# Altium project ARDUINO_MSP430F2370.PrjPCB
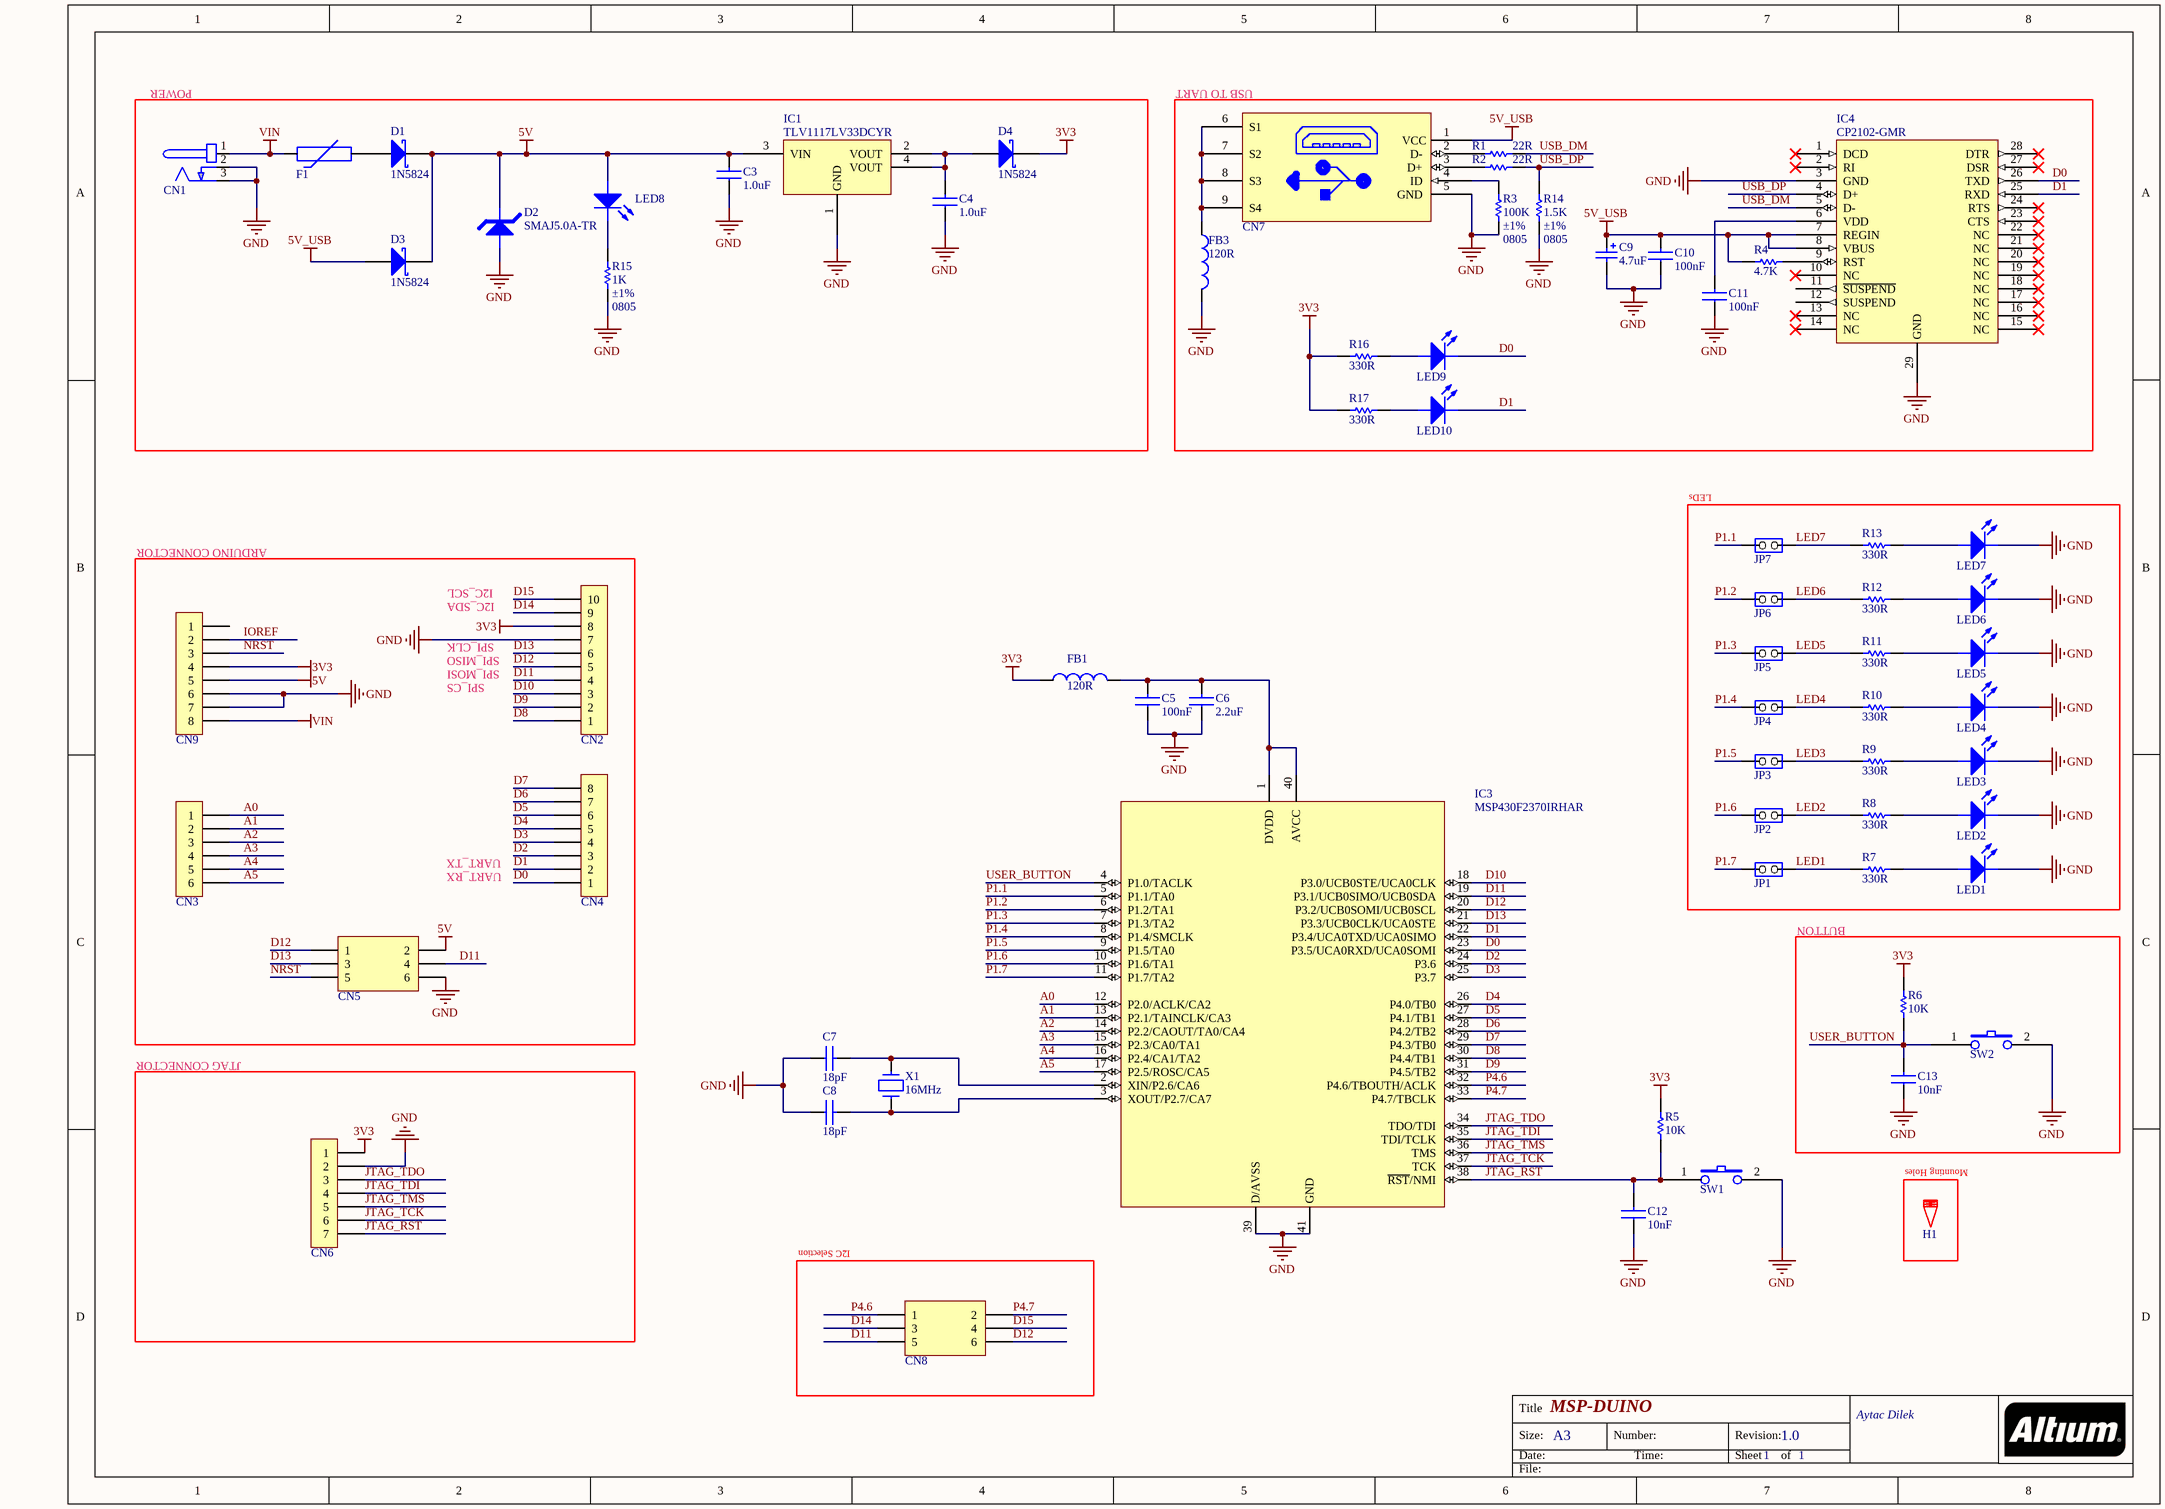
[diagram p0: ARDUINO_MSP430F2370.SchDoc]
1 sheet, 68 parts. Net scope: global (net labels, ports and power ports of the same name join across sheets).
Board file: ARDUINO_MSP430F2370.PcbDoc

## Sheet ARDUINO_MSP430F2370.SchDoc: MSP-DUINO
size A3; ApprovedBy: Aytac Dilek; CheckedBy: Aytac Dilek; Author: Aytac Dilek; Address1: Aytac Dilek; Revision: 1.0; SheetNumber: 1; SheetTotal: 1

### Parts
C3  value 1.0uF  [CAPC2012X100N_EIA0805]  (hidden comment: CAP_NP)
C4  value 1.0uF  [CAPC2012X100N_EIA0805]  (hidden comment: CAP_NP)
C5  value 100nF  [CAPC2012X100N_EIA0805]  (hidden comment: CAP_NP)
C6  value 2.2uF  [CAPC2012X100N_EIA0805]  (hidden comment: CAP_NP)
C7  value 18pF  [CAPC2012X100N_EIA0805]  (hidden comment: CAP_NP)
C8  value 18pF  [CAPC2012X100N_EIA0805]  (hidden comment: CAP_NP)
C9  value 4.7uF  [CAPMP3216X16N_EIA-1206_CASE-A]  (hidden comment: CAP_P)
C10  value 100nF  [CAPC2012X100N_EIA0805]  (hidden comment: CAP_NP)
C11  value 100nF  [CAPC2012X100N_EIA0805]  (hidden comment: CAP_NP)
C12  value 10nF  [CAPC2012X100N_EIA0805]  (hidden comment: CAP_NP)
C13  value 10nF  [CAPC2012X100N_EIA0805]  (hidden comment: CAP_NP)
CN1  DC_JACK  [DC_JACK]  (value not drawn)
CN2  HDR_1X10  [HDRFV10W70P254_1X10_2540X254X1118P]  (value not drawn)
CN3  HDR_1X6  [HDRFV6W70P254_1X6_1524X254X1118P]  (value not drawn)
CN4  HDR_1X8  [HDRFV8W70P254_1X8_2032X254X1118P]  (value not drawn)
CN5  HDR_2X3  [HDRV6W64P254_2X3_762X508X600P]  (value not drawn)
CN6  HDR_1X7  [HDRFV7W70P254_1X7_1778X254X1118P]  (value not drawn)
CN7  USB_MINI_TYPE_B  [OST_USB-M26FTR]  (value not drawn)
CN8  HDR_2X3  [HDRV6W64P254_2X3_762X508X600P]  (value not drawn)
CN9  HDR_1X8  [HDRFV8W70P254_1X8_2032X254X1118P]  (value not drawn)
D1  value 1N5824  [DIOM4436X24N_DO-214AA_SMB]  (hidden comment: DIODE_SCHOTTKY)
D2  value SMAJ5.0A-TR  [DIOM5126X26N_DO-214AC_SMA]  (hidden comment: DIODE_TVS_UNI)
D3  value 1N5824  [DIOM4436X24N_DO-214AA_SMB]  (hidden comment: DIODE_SCHOTTKY)
D4  value 1N5824  [DIOM4436X24N_DO-214AA_SMB]  (hidden comment: DIODE_SCHOTTKY)
F1  PTC  [FUSEC2012X18N]  (value not drawn)
FB1  Impedance: 120R  [FILC2012X100N_EIA0805]  (hidden comment: BEAD)
FB3  Impedance: 120R  [FILC2012X100N_EIA0805]  (hidden comment: BEAD)
H1  HOLES  [HOLE_125MIL]  (value not drawn)
IC1  TLV1117LV33DCYR  [SOT230P700X180-4N_[TEXAS]R-PDSO-G4]
IC3  Manufacturer Part Number: MSP430F2370IRHAR  [QFN50P600X600X100_HS-41N]  (hidden comment: MSP430F2370)
IC4  Manufacturer Part Number: CP2102-GMR  [QFN50P500X500X100_HS-29N]  (hidden comment: CP2102)
JP1  JP2  [HDRV2W64P254_1X2_508X254X600P]  (value not drawn)
JP2  JP2  [HDRV2W64P254_1X2_508X254X600P]  (value not drawn)
JP3  JP2  [HDRV2W64P254_1X2_508X254X600P]  (value not drawn)
JP4  JP2  [HDRV2W64P254_1X2_508X254X600P]  (value not drawn)
JP5  JP2  [HDRV2W64P254_1X2_508X254X600P]  (value not drawn)
JP6  JP2  [HDRV2W64P254_1X2_508X254X600P]  (value not drawn)
JP7  JP2  [HDRV2W64P254_1X2_508X254X600P]  (value not drawn)
LED1  LED  [LEDC2012X70N_EIA0805_BLUE]  (value not drawn)
LED2  LED  [LEDC2012X70N_EIA0805_ORANGE]  (value not drawn)
LED3  LED  [LEDC2012X70N_EIA0805_RED]  (value not drawn)
LED4  LED  [LEDC2012X70N_EIA0805_WHITE]  (value not drawn)
LED5  LED  [LEDC2012X70N_EIA0805_YELLOW]  (value not drawn)
LED6  LED  [LEDC2012X70N_EIA0805_GREEN]  (value not drawn)
LED7  LED  [LEDC2012X70N_EIA0805_GREEN]  (value not drawn)
LED8  LED  [LEDC2012X70N_EIA0805_GREEN]  (value not drawn)
LED9  LED  [LEDC2012X70N_EIA0805_BLUE]  (value not drawn)
LED10  LED  [LEDC2012X70N_EIA0805_RED]  (value not drawn)
R1  value 22R  [RESC2013X65N_EIA0805]  (hidden comment: RES)
R2  value 22R  [RESC2013X65N_EIA0805]  (hidden comment: RES)
R3  value 100K  Tolerance: ±1%  Package / Case: 0805  [RESC2013X65N_EIA0805]  (hidden comment: RES)
R4  value 4.7K  [RESC2013X65N_EIA0805]  (hidden comment: RES)
R5  value 10K  [RESC2013X65N_EIA0805]  (hidden comment: RES)
R6  value 10K  [RESC2013X65N_EIA0805]  (hidden comment: RES)
R7  value 330R  [RESC2013X65N_EIA0805]  (hidden comment: RES)
R8  value 330R  [RESC2013X65N_EIA0805]  (hidden comment: RES)
R9  value 330R  [RESC2013X65N_EIA0805]  (hidden comment: RES)
R10  value 330R  [RESC2013X65N_EIA0805]  (hidden comment: RES)
R11  value 330R  [RESC2013X65N_EIA0805]  (hidden comment: RES)
R12  value 330R  [RESC2013X65N_EIA0805]  (hidden comment: RES)
R13  value 330R  [RESC2013X65N_EIA0805]  (hidden comment: RES)
R14  value 1.5K  Tolerance: ±1%  Package / Case: 0805  [RESC2013X65N_EIA0805]  (hidden comment: RES)
R15  value 1K  Tolerance: ±1%  Package / Case: 0805  [RESC2013X65N_EIA0805]  (hidden comment: RES)
R16  value 330R  [RESC2013X65N_EIA0805]  (hidden comment: RES)
R17  value 330R  [RESC2013X65N_EIA0805]  (hidden comment: RES)
SW1  SWITCH_TACTILE_2PIN  [[C&K]RS-282G05A3-SM_RT]  (value not drawn)
SW2  SWITCH_TACTILE_2PIN  [[C&K]RS-282G05A3-SM_RT]  (value not drawn)
X1  value 16MHz  [HC-49/US]  (hidden comment: CRYSTAL)

### Blocks framed on the sheet
POWER: C3 C4 CN1 D1-D4 F1 IC1 LED8 R15
USB TO UART: C9-C11 CN7 FB3 IC4 LED9 LED10 R1-R4 R14 R16 R17
LEDs: JP1-JP7 LED1-LED7 R7-R13
BUTTON: C13 R6 SW2
JTAG CONNECTOR: CN6
Mounting Holes: H1
I2C Selection: CN8

### Nets
3V3: CN2.8 CN6.1 CN9.4 D4.1 FB1.1 R5.1 R6.1 R16.2 R17.2
5V: C3.2 CN5.2 CN9.5 D1.1 D2.1 D3.1 IC1.3(VIN) LED8.2
5V_USB: C9.1 C10.2 CN7.1(VCC) D3.2 IC4.7(REGIN) IC4.8(VBUS) R4.2
GND: C3.1 C4.1 C5.1 C6.1 C7.1 C8.1 C9.2 C10.1 C11.1 C12.1 C13.1 CN1.2(GND) CN1.3(GND) CN2.7 CN5.6 CN6.2 CN7.5(GND) CN9.6 CN9.7 D2.2 FB3.2 IC1.1(GND) IC3.39(D/AVSS) IC3.41(GND) IC4.3(GND) IC4.29(GND) LED1.1 LED2.1 LED3.1 LED4.1 LED5.1 LED6.1 LED7.1 R3.2 R14.2 R15.2 SW1.2(A1) SW2.2(A1)
VIN: CN1.1(+) CN9.8 F1.1
A0: CN3.1 IC3.12(P2.0/ACLK/CA2)
A1: CN3.2 IC3.13(P2.1/TAINCLK/CA3)
A2: CN3.3 IC3.14(P2.2/CAOUT/TA0/CA4)
A3: CN3.4 IC3.15(P2.3/CA0/TA1)
A4: CN3.5 IC3.16(P2.4/CA1/TA2)
A5: CN3.6 IC3.17(P2.5/ROSC/CA5)
D0: CN4.1 IC3.23(P3.5/UCA0RXD/UCA0SOMI) IC4.26(TXD) LED9.1
D1: CN4.2 IC3.22(P3.4/UCA0TXD/UCA0SIMO) IC4.25(RXD) LED10.1
D2: CN4.3 IC3.24(P3.6)
D3: CN4.4 IC3.25(P3.7)
D4: CN4.5 IC3.26(P4.0/TB0)
D5: CN4.6 IC3.27(P4.1/TB1)
D6: CN4.7 IC3.28(P4.2/TB2)
D7: CN4.8 IC3.29(P4.3/TB0)
D8: CN2.1 IC3.30(P4.4/TB1)
D9: CN2.2 IC3.31(P4.5/TB2)
D10: CN2.3 IC3.18(P3.0/UCB0STE/UCA0CLK)
D11: CN2.4 CN5.4 CN8.5 IC3.19(P3.1/UCB0SIMO/UCB0SDA)
D12: CN2.5 CN5.1 CN8.6 IC3.20(P3.2/UCB0SOMI/UCB0SCL)
D13: CN2.6 CN5.3 IC3.21(P3.3/UCB0CLK/UCA0STE)
D14: CN2.9 CN8.3
D15: CN2.10 CN8.4
IOREF: CN9.2
JTAG_RST: C12.2 CN6.7 IC3.38(~{RST}/NMI) R5.2 SW1.1(A0)
JTAG_TCK: CN6.6 IC3.37(TCK)
JTAG_TDI: CN6.4 IC3.35(TDI/TCLK)
JTAG_TDO: CN6.3 IC3.34(TDO/TDI)
JTAG_TMS: CN6.5 IC3.36(TMS)
LED1: JP1.2(NO) R7.2
LED2: JP2.2(NO) R8.2
LED3: JP3.2(NO) R9.2
LED4: JP4.2(NO) R10.2
LED5: JP5.2(NO) R11.2
LED6: JP6.2(NO) R12.2
LED7: JP7.2(NO) R13.2
~{NRST}: CN5.5 CN9.3
P1.1: IC3.5(P1.1/TA0) JP7.1(COMMON)
P1.2: IC3.6(P1.2/TA1) JP6.1(COMMON)
P1.3: IC3.7(P1.3/TA2) JP5.1(COMMON)
P1.4: IC3.8(P1.4/SMCLK) JP4.1(COMMON)
P1.5: IC3.9(P1.5/TA0) JP3.1(COMMON)
P1.6: IC3.10(P1.6/TA1) JP2.1(COMMON)
P1.7: IC3.11(P1.7/TA2) JP1.1(COMMON)
P4.6: CN8.1 IC3.32(P4.6/TBOUTH/ACLK)
P4.7: CN8.2 IC3.33(P4.7/TBCLK)
USB_DM: IC4.5(D-) R1.1
USB_DP: IC4.4(D+) R2.1 R14.1
USER_BUTTON: C13.2 IC3.4(P1.0/TACLK) R6.2 SW2.1(A0)
NetC4_2: C4.2 D4.2 IC1.2(VOUT) IC1.4(VOUT)
NetC5_2: C5.2 C6.2 FB1.2 IC3.1(DVDD) IC3.40(AVCC)
NetC7_2: C7.2 IC3.2(XIN/P2.6/CA6) X1.1
NetC8_2: C8.2 IC3.3(XOUT/P2.7/CA7) X1.2
NetC11_2: C11.2 IC4.6(VDD)
NetCN7_2: CN7.2(D-) R1.2
NetCN7_3: CN7.3(D+) R2.2
NetCN7_4: CN7.4(ID) R3.1
NetCN7_6: CN7.6(S1) CN7.7(S2) CN7.8(S3) CN7.9(S4) FB3.1
NetD1_2: D1.2 F1.2
NetIC4_9: IC4.9(RST) R4.1
NetLED1_2: LED1.2 R7.1
NetLED2_2: LED2.2 R8.1
NetLED3_2: LED3.2 R9.1
NetLED4_2: LED4.2 R10.1
NetLED5_2: LED5.2 R11.1
NetLED6_2: LED6.2 R12.1
NetLED7_2: LED7.2 R13.1
NetLED8_1: LED8.1 R15.1
NetLED9_2: LED9.2 R16.1
NetLED10_2: LED10.2 R17.1

Not connected (* = marked no-connect by the designer): CN9 1; IC4 1(DCD)* 2(RI)* 10(NC)* 11(~{SUSPEND}) 12(SUSPEND) 13(NC)* 14(NC)* 15(NC)* 16(NC)* 17(NC)* 18(NC)* 19(NC)* 20(NC)* 21(NC)* 22(NC)* 23(CTS)* 24(RTS)* 27(DSR)* 28(DTR)*

### Notes on the sheet
- ARDUINO CONNECTOR
- I2C_SCL
- SPI_CLK
- SPI_MISO
- I2C_SDA
- SPI_MOSI
- SPI_CS
- UART_TX
- UART_RX
- Title
- Size:
- Date:
- A3
- Number:
- Time:
- Revision:
- Sheet
- of
- File:

### Library data of the parts
C3 C4 = SCAP00310053: CAP CER 1UF 25V 10% X7R 0603; Manufacturer: Samsung Electro-Mechanics America, Inc; Manufacturer Part Number: CL21B105KAFNNNE; Capacitance: 1.0µF; Type: Multi Layer Ceramic Capacitor  (MLCC); Cost x1 ($): 0.12; Cost x10 ($): 0.08700; Cost x100 ($): 0.03970; Cost x1000 ($): 0.02166; Distrubutor: Digikey; Part Number: SCAP00310053; Tolerance: ±10%; Voltage - Rated: 25V; Package / Case: 0805; Temperature Coefficient: X7R; Operating Temperature: -55°C ~ 125°C; Category: Capacitors; Family: Ceramic Capacitors; Distributor Part Number: 1276-1066-1-ND; Distributor Link: http://www.digikey.com/product-detail/en/CL21B105KAFNNNE/1276-1066-1-ND/3889152; ROHS: YES
C5 C10 C11 = SCAP00310048: CAP CER 0.1UF 50V 10% X7R 0603; Manufacturer: Samsung Electro-Mechanics America, Inc; Manufacturer Part Number: CL21B104KBCNNNC; Capacitance: 0.1µF; Type: Multi Layer Ceramic Capacitor  (MLCC); Cost x1 ($): 0.10000; Cost x10 ($): 0.04600; Cost x100 ($): 0.02090; Cost x1000 ($): 0.01140; Distrubutor: Digikey; Part Number: SCAP00310048; Tolerance: ±10%; Voltage - Rated: 50V; Package / Case: 0805; Temperature Coefficient: X7R; Operating Temperature: -55°C ~ 125°C; Category: Capacitors; Family: Ceramic Capacitors; Distributor Part Number: 1276-1003-1-ND; Distributor Link: http://www.digikey.com/product-detail/en/CL21B104KBCNNNC/1276-1003-1-ND/3889089; ROHS: YES
C6 = SCAP00300098: CAP CER 2.2UF 16V X5R 0805; Manufacturer: Murata Electronics North America; Manufacturer Part Number: GRM219R61C225KA88D; Capacitance: 2.2µF; Tolerance: ±10%; Type: Multi Layer Ceramic Capacitor  (MLCC); Cost x1 ($): 0.25000; Cost x10 ($): 0.20800; Cost x100 ($): 0.10400; Cost x1000 ($): 0.06110; Distrubutor: Digikey; Lead Time: 12 Weeks; Part Number: SCAP00300098; Voltage - Rated: 16V; Package / Case: 0805; Temperature Coefficient: X5R; Operating Temperature: -55°C ~ 85°C; Mounting Type: Surface Mount, MLCC; Size / Dimension: 0.079" L x 0.049" W (2.00mm x 1.25mm); Category: Capacitors; Family: Ceramic Capacitors; Distributor Part Number: 490-3902-1-ND; Distributor Link: http://www.digikey.com/product-detail/en/murata-electronics-north-america/GRM219R61C225KA88D/490-3902-1-ND/965944; ROHS: YES; Moisture Sensitivity Level (MSL): 1 (Unlimited); Quantity: 0
C7 C8 = SCAP00310014: CAP CER 18PF 50V 5% NP0 0603; Manufacturer: Samsung Electro-Mechanics America, Inc; Manufacturer Part Number: CL21C180JBANNNC; Temperature Coefficient: C0G, NP0; Type: Multi Layer Ceramic Capacitor  (MLCC); Cost x1 ($): 0.10000; Cost x10 ($): 0.04800; Cost x100 ($): 0.02200; Cost x1000 ($): 0.01200; Distrubutor: Digikey; Part Number: SCAP00310014; Capacitance: 18pF; Tolerance: ±5%; Voltage - Rated: 50V; Package / Case: 0805; Operating Temperature: -55°C ~ 125°C; Category: Capacitors; Family: Ceramic Capacitors; Distributor Part Number: 1276-1107-1-ND; Distributor Link: http://www.digikey.com/product-detail/en/CL21C180JBANNNC/1276-1107-1-ND/3889193; ROHS: YES
C9 = SCAP00367: CAP TANT 4.7UF 16V 10% 1206; Manufacturer: AVX Corporation; Manufacturer Part Number: TAJA475K016RNJ; Capacitance: 4.7µF; ESR (Equivalent Series Resistance): 4 Ohm; Type: Molded; Cost x1 ($): 0.56000; Cost x10 ($): 0.53600; Cost x100 ($): 0.26000; Cost x1000 ($): 0.18000; Distrubutor: Digikey; Part Number: SCAP00367; Tolerance: ±10%; Voltage - Rated: 16V; Package / Case: 1206 (3216 Metric); Operating Temperature: -55°C ~ 125°C; Category: Capacitors; Family: Tantalum Capacitors; Distributor Part Number: 478-3868-1-ND; Distributor Link: http://www.digikey.com/product-detail/en/TAJA475K016RNJ/478-3868-1-ND/1126914; ROHS: YES; Quantity: 20
C12 C13 = SCAP00310042: CAP CER 10000PF 50V 10% X7R 0603; Manufacturer: Samsung Electro-Mechanics America, Inc; Manufacturer Part Number: CL21B103KBANNNC; Type: Multi Layer Ceramic Capacitor  (MLCC); Cost x1 ($): 0.10000; Cost x10 ($): 0.03100; Cost x100 ($): 0.01420; Cost x1000 ($): 0.00777; Distrubutor: Digikey; Part Number: SCAP00310042; Capacitance: 10000pF; Tolerance: ±10%; Voltage - Rated: 50V; Package / Case: 0805; Temperature Coefficient: X7R; Operating Temperature: -55°C ~ 125°C; Category: Capacitors; Family: Ceramic Capacitors; Distributor Part Number: 1276-1015-1-ND; Distributor Link: http://www.digikey.com/product-detail/en/CL21B103KBANNNC/1276-1015-1-ND/3889101; ROHS: YES; Quantity: 50
CN1 = SCON00027: CONN POWER JACK MALE 2.5MM CLSD; Manufacturer: CUI Inc; Manufacturer Part Number: PJ-002B; Voltage: 24VDC; Current: 2.5A; Distrubutor: Digikey; Lead Time: 10 Weeks; Cost x1 ($): 0.93000; Cost x10 ($): 0.65100; Cost x100 ($): 0.43710; Cost x1000 ($): 0.31620; Part Number: SCON00027; Value: DC_JACK; Category: Connectors, Interconnects; Family: Barrel - Power Connectors; Connector Type: Jack; Contact Type: Male; Mounting Type: Through Hole, Right Angle; Packaging: Bulk; Contact Finish: Silver; Distributor Part Number: CP-002B-ND; Datasheet Link: http://www.digikey.com/product-detail/en/PJ-002B/CP-002B-ND/96965; ROHS: YES; Moisture Sensitivity Level (MSL): 1 (Unlimited); Part Status: Active; Quantity: 20
CN2 = SCON00126: CONN ARDUINO HEADER .0100" 10POS; Manufacturer: Sparkfun; Manufacturer Part Number: PRT-11376; Pitch: 2.54mm; Connector Type: Stackable Header; Cost x1 ($): 0.50; Cost x100 ($): 0.48; Cost x1000 ($): 0.45; Part Number: SCON00126; Value: HDR_1X10; Category: Connectors, Interconnects; Family: Rectangular Connectors - Headers, Receptacles, Female Sockets; Contact Type: Female Socket; Mounting Type: Through Hole; Distrubutor: Sparkfun; Distributor Part Number: PRT-11376; Datasheet Link: https://www.sparkfun.com/products/11376; ROHS: YES; Quantity: 10; Cost x10 ($): 0.50
CN3 = SCON00124: CONN ARDUINO HEADER .0100" 6POS; Manufacturer: Sparkfun; Manufacturer Part Number: PRT-09280; Pitch: 2.54mm; Connector Type: Stackable Header; Cost x1 ($): 0.50; Cost x100 ($): 0.48; Cost x1000 ($): 0.45; Part Number: SCON00124; Value: HDR_1X6; Category: Connectors, Interconnects; Family: Rectangular Connectors - Headers, Receptacles, Female Sockets; Contact Type: Female Socket; Mounting Type: Through Hole; Distrubutor: Sparkfun; Distributor Part Number: PRT-09280; Datasheet Link: https://www.sparkfun.com/products/9280; ROHS: YES; Quantity: 10; Cost x10 ($): 0.50
CN4 CN9 = SCON00125: CONN ARDUINO HEADER .0100" 8POS; Manufacturer: Sparkfun; Manufacturer Part Number: PRT-09279; Pitch: 2.54mm; Connector Type: Stackable Header; Cost x1 ($): 0.50; Cost x100 ($): 0.48; Cost x1000 ($): 0.45; Part Number: SCON00125; Value: HDR_1X8; Category: Connectors, Interconnects; Family: Rectangular Connectors - Headers, Receptacles, Female Sockets; Contact Type: Female Socket; Mounting Type: Through Hole; Distrubutor: Sparkfun; Distributor Part Number: PRT-09279; Datasheet Link: https://www.sparkfun.com/products/9279; ROHS: YES; Quantity: 10; Cost x10 ($): 0.50
CN5 CN8 = SCON00128: CONN HEADER FMALE 6PS .1" DL TIN; Manufacturer: Sullins Connector Solutions; Manufacturer Part Number: PPTC032LFBN-RC; Pitch: 2.54mm; Distrubutor: Digikey; Cost x1 ($): 0.80000; Cost x10 ($): 0.62200; Cost x100 ($): 0.47480; Cost x1000 ($): 0.33760; Part Number: SCON00128; Value: HDR_2X3; Category: Connectors, Interconnects; Family: Rectangular Connectors - Headers, Receptacles, Female Sockets; Connector Type: Header; Contact Type: Female Socket; Mounting Type: Through Hole; Distributor Part Number: S7071-ND; Datasheet Link: http://www.digikey.com/product-detail/en/sullins-connector-solutions/PPTC032LFBN-RC/S7071-ND/810210; ROHS: YES; Quantity: 0
CN6 = SCON00129: CONN ARDUINO HEADER .0100" 7POS; Manufacturer: Wurth Electronics Inc; Manufacturer Part Number: 61300711121; Pitch: 2.54mm; Distrubutor: Digikey; Lead Time: 18 Weeks; Cost x1 ($): 0.35000; Cost x100 ($): 0.31590; Cost x1000 ($): 0.26730; Part Number: SCON00129; Value: HDR_1X7; Category: Connectors, Interconnects; Family: Rectangular Connectors - Headers, Receptacles, Female Sockets; Connector Type: Header; Contact Type: Female Socket; Mounting Type: Through Hole; Distributor Part Number: 732-5320-ND; Datasheet Link: http://www.digikey.com/product-detail/en/wurth-electronics-inc/61300711121/732-5320-ND/4846837; ROHS: YES; Moisture Sensitivity Level (MSL): 1 (Unlimited); Part Status: Active; Quantity: 0; Cost x10 ($): 0.35000
CN7 = SCON00017: CONN USB MINI B R/A SMD; Manufacturer: On Shore Technology; Manufacturer Part Number: USB-M26FTR; Value: OST_USB MINI B; Distrubutor: Digikey; Lead Time: 8 Weeks; Cost x1 ($): 0.87000; Cost x10 ($): 0.76600; Cost x100 ($): 0.66070; Cost x1000 ($): 0.60060; Part Number: SCON00017; Category: Connectors, Interconnects; Family: USB MINI B; Mounting Type: Surface Mount, Right Angle, Horizontal; Distributor Part Number: ED2992CT-ND; Datasheet Link: http://www.digikey.com/product-search/en?keywords=ED2992CT-ND; ROHS: YES; Moisture Sensitivity Level (MSL): 1 (Unlimited); Part Status: Active; Quantity: 0
D1 D3 D4 = SSEM00019: DIODE SCHOTTKY 5A 40V SMA; Manufacturer: Micro Commercial Co; Manufacturer Part Number: SK54B-LTP; Distrubutor: Digikey; Lead Time: 1 (Unlimited); Cost x10 ($): 0.42000; Cost x100 ($): 0.28840; Cost x1000 ($): 0.14832; Cost x1 ($): 0.54000; Part Number: SSEM00019; Category: Discrete Semiconductor Products; Family: Diodes - Rectifiers - Single; Package / Case: DO-214AA, SMB; Type: Schottky; Distributor Part Number: SK54B-LTPMSCT-ND; ROHS: YES; Datasheet Link: http://www.digikey.com/product-detail/en/micro-commercial-co/SK54B-LTP/SK54B-LTPMSCT-ND/5865087; Moisture Sensitivity Level (MSL): 8 Weeks; Quantity: 0
D2 = SCP00004: TVS DIODE 5VWM 13.4VC DO214AC; Manufacturer: STMicroelectronics; Voltage - Reverse Standoff (Typ): 5V; Voltage - Breakdown (Min): 6.4V; Power - Peak Pulse: 400W; Type: Zener; Cost x10 ($): 0.29600; Cost x100 ($): 0.18420; Cost x1000 ($): 0.09682; Distrubutor: Digikey; Lead Time: 11 Weeks; Cost x1 ($): 0.39000; Part Number: SCP00004; Category: Circuit Protection; Family: TVS - Diodes; Package / Case: DO-214AC, SMA; Manufacturer Part Number: SMAJ5.0A-TR; Distributor Part Number: 497-2999-1-ND; ROHS: YES; Datasheet Link: http://www.digikey.com/product-detail/en/stmicroelectronics/SMAJ5.0A-TR/497-2999-1-ND/634866; Moisture Sensitivity Level (MSL): 1 (Unlimited); Quantity: 0
F1 = SCP00003: PTC RESTTBLE 1.0A 6V CHIP 0805; Manufacturer: Bel Fuse Inc.; Value: 0ZCK0100FF2E; Cost x10 ($): 0.27000; Cost x100 ($): 0.22410; Cost x1000 ($): 0.15761; Distrubutor: Digikey; Lead Time: 18 Weeks; Cost x1 ($): 0.29000; Part Number: SCP00003; Category: Circuit Protection; Family: PTC Resettable Fuses; Package / Case: 0805 (2012 Metric), Concave; Manufacturer Part Number: 0ZCK0100FF2E; Distributor Part Number: 507-1815-1-ND; ROHS: YES; Datasheet Link: http://www.digikey.com/product-detail/en/bel-fuse-inc/0ZCK0100FF2E/507-1815-1-ND/4156258; Moisture Sensitivity Level (MSL): 2A (4 Weeks); Quantity: 0
FB1 FB3 = SFIL00005: FERRITE CHIP POWER 120 OHM SMD; Manufacturer: Laird-Signal Integrity Products; Manufacturer Part Number: HI0805O121R-10; Type: Differential Mode - Single; Current Rating: 3.5A; DC Resistance (DCR): 20 mOhm Max; Cost x10 ($): 0.08700; Cost x100 ($): 0.05230; Cost x1000 ($): 0.03010; Distrubutor: Digikey; Cost x1 ($): 0.10000; Part Number: SFIL00005; Package / Case: 0805 (2012 Metric); Value: BEAD; Category: Filters; Family: Ferrite Beads and Chips; Distributor Part Number: 240-2393-1-ND; ROHS: YES; Datasheet Link: http://www.digikey.com/product-detail/en/HI0805O121R-10/240-2393-1-ND/806753; Quantity: 50
H1 = SMSC00005: Value: HOLE_125MIL; Part Number: SMSC00005
IC1 = SIC00137: IC REG LDO 3.3V 1A SOT223; Manufacturer: Texas Instruments; Vin: Up to 5.5V; Iout: 1.1A; Cost x10 ($): 0.56400; Cost x100 ($): 0.43160; Cost x1000 ($): 0.27390; Distrubutor: Digikey; Lead Time: 6 Weeks; Cost x1 ($): 0.64000; Part Number: SIC00137; Manufacturer Part Number: TLV1117LV33DCYR; Value: TLV1117LV33DCYR; Vout: 3.3V; Operating Temperature: -40°C ~ 125°C; Category: Integrated Circuits (ICs); Family: PMIC - Voltage Regulators - Linear; Package / Case: SOT-223-4, TO-261-4, TO-261AA; Type: Positive Fixed; Distributor Part Number: 296-28778-1-ND; ROHS: YES; Distributor Link: http://www.digikey.com/product-detail/en/texas-instruments/TLV1117LV33DCYR/296-28778-1-ND/2666520; MSL: 1 (Unlimited); Quantity: 0
IC3 = SIC00129: IC MCU 16BIT 32KB FLASH 40VQFN; Manufacturer: Texas Instruments; Vin: 1.8 V ~ 3.6 V; Protocol: I²C, IrDA, LIN, SCI, SPI, UART/USART; Speed: 16MHz; Cost x10 ($): 4.30000; Cost x100 ($): 3.52760; Cost x1000 ($): 2.19375; Distrubutor: Digikey; Cost x1 ($): 4.79000; Part Number: SIC00129; Value: MSP430F2370; Operating Temperature: -40°C ~ 85°C; Category: Integrated Circuits (ICs); Family: Embedded - Microcontrollers; Package / Case: 40-VFQFN Exposed Pad; Type: MSP430F2xx; Distributor Part Number: 296-24340-1-ND; ROHS: YES; Distributor Link: http://www.digikey.com/product-detail/en/texas-instruments/MSP430F2370IRHAR/296-24340-1-ND/2048564; Quantity: 0
IC4 = SIC00136: IC USB-TO-UART BRIDGE 28VQFN; Manufacturer: Silicon Labs; Vin: 3 V ~ 3.6 V; Protocol: UART; Cost x10 ($): 2.88000; Cost x100 ($): 2.66680; Distrubutor: Digikey; Lead Time: 6 Weeks; Part Number: SIC00136; Value: CP2102; Operating Temperature: -40°C ~ 85°C; Category: Integrated Circuits (ICs); Family: Interface - Controllers; Package / Case: 28-VFQFN Exposed Pad; Type: Bridge, USB to UART; Cost x1000 ($): 2.66680; Distributor Part Number: 336-1160-1-ND; ROHS: YES; Distributor Link: http://www.digikey.com/product-detail/en/silicon-labs/CP2102-GMR/336-1160-1-ND/3672615; MSL: 1 (Unlimited); Quantity: 0; Cost x1 ($): 2.88000
JP1-JP7 = SCON00130: SIL VERTICAL PC TAIL PIN HEADER; Manufacturer: Harwin Inc.; Manufacturer Part Number: M20-9990246; Value: JUMPER_2; Pitch: 2.54mm; Connector Type: Male Pin; Distrubutor: Digikey; Lead Time: 5 Weeks; Cost x1 ($): 0.10000; Cost x10 ($): 0.05400; Cost x100 ($): 0.04410; Cost x1000 ($): 0.02993; Part Number: SCON00130; Category: Connectors, Interconnects; Family: Rectangular Connectors - Headers, Male Pins; Contact Type: Header, Unshrouded; Mounting Type: Through Hole; Distributor Part Number: 952-2262-ND; Datasheet Link: http://www.digikey.com/product-detail/en/harwin-inc/M20-9990246/952-2262-ND/3728226; ROHS: YES; Moisture Sensitivity Level (MSL): 1 (Unlimited); Part Status: Active; Quantity: 0
LED1 LED9 = SOPT00001: LED BLUE CLEAR 0805 SMD; Manufacturer: Lite-On Inc; Manufacturer Part Number: LTST-C170TBKT; Value: LED_BLUE; Cost x10 ($): 0.27700; Cost x100 ($): 0.18220; Cost x1000 ($): 0.09936; Distrubutor: Digikey; Cost x1 ($): 0.39000; Part Number: SOPT00001; Package / Case: 0805 (2012 Metric); Category: Optoelectronics; Family: LED Indication - Discrete; Type: LED; Distributor Part Number: 160-1579-1-ND; ROHS: YES; Datasheet Link: http://www.digikey.com/product-detail/en/LTST-C170TBKT/160-1579-1-ND/564889; Quantity: 110
LED2 = SOPT00003: LED ORANGE CLEAR 0805 SMD; Manufacturer: Lite-On Inc; Manufacturer Part Number: LTST-C170KFKT; Value: LED_ORANGE; Cost x10 ($): 0.24800; Cost x100 ($): 0.13500; Cost x1000 ($): 0.05850; Distrubutor: Digikey; Cost x1 ($): 0.32000; Part Number: SOPT00003; Package / Case: 0805 (2012 Metric); Category: Optoelectronics; Family: LED Indication - Discrete; Type: LED; Distributor Part Number: 160-1413-1-ND; ROHS: YES; Datasheet Link: http://www.digikey.com/product-detail/en/LTST-C170KFKT/160-1413-1-ND/386774; Quantity: 100
LED3 LED10 = SOPT00004: LED SUPER RED CLR THIN 0805 SMD; Manufacturer: Lite-On Inc; Manufacturer Part Number: LTST-C171KRKT; Value: LED_RED; Cost x10 ($): 0.24800; Cost x100 ($): 0.13500; Cost x1000 ($): 0.05850; Distrubutor: Digikey; Cost x1 ($): 0.32000; Part Number: SOPT00004; Package / Case: 0805 (2012 Metric); Category: Optoelectronics; Family: LED Indication - Discrete; Type: LED; Distributor Part Number: 160-1427-1-ND; ROHS: YES; Datasheet Link: http://www.digikey.com/product-detail/en/LTST-C171KRKT/160-1427-1-ND/386800; Quantity: 110
LED4 = SOPT00005: LED WHITE YELLOW 280MCD 0805; Manufacturer: Lite-On Inc; Manufacturer Part Number: LTW-170TK; Value: LED_WHITE; Cost x10 ($): 0.44700; Cost x100 ($): 0.28980; Cost x1000 ($): 0.16560; Distrubutor: Digikey; Cost x1 ($): 0.58000; Part Number: SOPT00005; Package / Case: 0805 (2012 Metric); Category: Optoelectronics; Family: LED Indication - Discrete; Type: LED; Distributor Part Number: 160-1738-1-ND; ROHS: YES; Datasheet Link: http://www.digikey.com/product-detail/en/LTW-170TK/160-1738-1-ND/758710; Quantity: 100
LED5 = SOPT00006: LED YELLOW CLEAR RT ANG 0805; Manufacturer: Lite-On Inc; Manufacturer Part Number: LTST-S220KSKT; Value: LED_YELLOW; Cost x10 ($): 0.27000; Cost x100 ($): 0.14310; Cost x1000 ($): 0.06750; Distrubutor: Digikey; Cost x1 ($): 0.36000; Part Number: SOPT00006; Package / Case: 0805 (2012 Metric); Category: Optoelectronics; Family: LED Indication - Discrete; Type: LED; Distributor Part Number: 160-1470-1-ND; ROHS: YES; Datasheet Link: http://www.digikey.com/product-detail/en/LTST-S220KSKT/160-1470-1-ND/386878; Quantity: 110
LED6-LED8 = SOPT00002: LED GREEN CLEAR THIN 0805 SMD; Manufacturer: Lite-On Inc; Manufacturer Part Number: LTST-C171KGKT; Value: LED_GREEN; Cost x10 ($): 0.24800; Cost x100 ($): 0.13500; Cost x1000 ($): 0.05850; Distrubutor: Digikey; Cost x1 ($): 0.32000; Part Number: SOPT00002; Package / Case: 0805 (2012 Metric); Category: Optoelectronics; Family: LED Indication - Discrete; Type: LED; Distributor Part Number: 160-1426-1-ND; ROHS: YES; Datasheet Link: http://www.digikey.com/product-detail/en/LTST-C171KGKT/160-1426-1-ND/386798; Quantity: 124
R1 R2 = SRES03010034: RES SMD 22 OHM 1% 1/8W 0805; Manufacturer: Yageo; Manufacturer Part Number: RC0805FR-0722RL; Resistance (Ohm): 22; Power (Watts): 0.125W, 1/8W; Cost x1 ($): 0.10; Cost x10 ($): 0.21; Cost x100 ($): 0.84; Cost x1000 ($): 3.79; Distrubutor: Digikey; Part Number: SRES03010034; Tolerance: ±1%; Package / Case: 0805; Category: Resistors; Family: Chip Resistor - Surface Mount; Distributor Part Number: 311-22.0CRCT-ND; Distributor Link: http://www.digikey.com/product-detail/en/RC0805FR-0722RL/311-22.0CRCT-ND/730682; ROHS: YES; Quantity: 0
R3 = SRES03010122: RES SMD 100K OHM 1% 1/8W 0805; Manufacturer: Yageo; Manufacturer Part Number: RC0805FR-07100KL; Power (Watts): 0.125W, 1/8W; Cost x1 ($): 0.10; Cost x10 ($): 0.21; Cost x100 ($): 0.84; Cost x1000 ($): 3.79; Distrubutor: Digikey; Part Number: SRES03010122; Resistance (Ohm): 100K; Category: Resistors; Family: Chip Resistor - Surface Mount; Distributor Part Number: 311-100KCRCT-ND; Distributor Link: http://www.digikey.com/product-detail/en/RC0805FR-07100KL/311-100KCRCT-ND/730491; ROHS: YES; Quantity: 0
R4 = SRES03010090: RES SMD 4.7K OHM 1% 1/8W 0805; Manufacturer: Yageo; Manufacturer Part Number: RC0805FR-074K7L; Power (Watts): 0.125W, 1/8W; Cost x1 ($): 0.10; Cost x10 ($): 0.21; Cost x100 ($): 0.84; Cost x1000 ($): 3.79; Distrubutor: Digikey; Part Number: SRES03010090; Tolerance: ±1%; Package / Case: 0805; Resistance (Ohm): 4.7K; Category: Resistors; Family: Chip Resistor - Surface Mount; Distributor Part Number: 311-4.70KCRCT-ND; Distributor Link: http://www.digikey.com/product-detail/en/RC0805FR-074K7L/311-4.70KCRCT-ND/730876; ROHS: YES; Quantity: 0
R5 R6 = SRES03010098: RES SMD 10K OHM 1% 1/8W 0805; Manufacturer: Yageo; Manufacturer Part Number: RC0805FR-0710KL; Power (Watts): 0.125W, 1/8W; Cost x1 ($): 0.10; Cost x10 ($): 0.21; Cost x100 ($): 0.84; Cost x1000 ($): 3.79; Distrubutor: Digikey; Part Number: SRES03010098; Tolerance: ±1%; Package / Case: 0805; Resistance (Ohm): 10K; Category: Resistors; Family: Chip Resistor - Surface Mount; Distributor Part Number: 311-10.0KCRCT-ND; Distributor Link: http://www.digikey.com/product-detail/en/RC0805FR-0710KL/311-10.0KCRCT-ND/730482; ROHS: YES; Quantity: 0
R7-R13 R16 R17 = SRES03010062: RES SMD 330 OHM 1% 1/8W 0805; Manufacturer: Yageo; Manufacturer Part Number: RC0805FR-07330RL; Resistance (Ohm): 330; Power (Watts): 0.125W, 1/8W; Cost x1 ($): 0.10; Cost x10 ($): 0.21; Cost x100 ($): 0.84; Cost x1000 ($): 3.79; Distrubutor: Digikey; Part Number: SRES03010062; Tolerance: ±1%; Package / Case: 0805; Category: Resistors; Family: Chip Resistor - Surface Mount; Distributor Part Number: 311-330CRCT-ND; Distributor Link: http://www.digikey.com/product-detail/en/RC0805FR-07330RL/311-330CRCT-ND/730813; ROHS: YES; Quantity: 0
R14 = SRES03010078: RES SMD 1.5K OHM 1% 1/8W 0805; Manufacturer: Yageo; Manufacturer Part Number: RC0805FR-071K5L; Power (Watts): 0.125W, 1/8W; Cost x1 ($): 0.10; Cost x10 ($): 0.21; Cost x100 ($): 0.84; Cost x1000 ($): 3.79; Distrubutor: Digikey; Part Number: SRES03010078; Resistance (Ohm): 1.5K; Category: Resistors; Family: Chip Resistor - Surface Mount; Distributor Part Number: 311-1.50KCRCT-ND; Distributor Link: http://www.digikey.com/product-detail/en/RC0805FR-071K5L/311-1.50KCRCT-ND/730443; ROHS: YES; Quantity: 0
R15 = SRES03010074: RES SMD 1K OHM 1% 1/8W 0805; Manufacturer: Yageo; Manufacturer Part Number: RC0805FR-071KL; Power (Watts): 0.125W, 1/8W; Cost x1 ($): 0.10; Cost x10 ($): 0.21; Cost x100 ($): 0.84; Cost x1000 ($): 3.79; Distrubutor: Digikey; Part Number: SRES03010074; Resistance (Ohm): 1K; Category: Resistors; Family: Chip Resistor - Surface Mount; Distributor Part Number: 311-1.00KCRCT-ND; Distributor Link: http://www.digikey.com/product-detail/en/RC0805FR-071KL/311-1.00KCRCT-ND/730391; ROHS: YES; Quantity: 0
SW1 SW2 = SSWI00022: SWITCH TACTILE SPST-NO 0.05A 12V; Manufacturer: C&K Components; Manufacturer Part Number: RS-282G05A3-SM RT; Value: SWITCH_TACTILE_MICRO_2PIN; Voltage: 12VDC; Current: 0.5A; Distrubutor: Digikey; Lead Time: 10 Weeks; Cost x10 ($): 0.72900; Cost x100 ($): 0.55000; Cost x1000 ($): 0.39875; Cost x1 ($): 0.76000; Part Number: SSWI00022; Package: SMD; Category: Switches; Family: Tactile Switches; Circuit: SPST-NO; Distributor Part Number: CKN10384CT-ND; Distrubutor Link: http://www.digikey.com/product-detail/en/c-k-components/RS-282G05A3-SM-RT/CKN10384CT-ND/2747203; ROHS: YES; Datasheet Link: 0; Moisture Sensitivity Level (MSL): 1 (Unlimited)
X1 = SCRY00011: CRYSTAL 16.0000MHZ 20PF T/H; Manufacturer: CTS-Frequency Controls; Manufacturer Part Number: ATS16A-E; Frequency Tolerance: ±30ppm; ESR: 40 Ohm; Distrubutor: Digikey; Lead Time: 7 Weeks; Cost x10 ($): 0.30000; Cost x100 ($): 0.24000; Cost x1000 ($): 0.19200; Cost x1 ($): 0.36000; Part Number: SCRY00011; Mounting Type: Through Hole; Load Capacitance: 20pF; Package / Case: HC49/US; Type: MHz Crystal; Distributor Part Number: CTX1084-ND; ROHS: YES; Datasheet Link: http://www.digikey.com/product-detail/en/ATS16A-E/CTX1084-ND/2640062; Quantity: 12